# Altium project ADV7513.PrjPcb
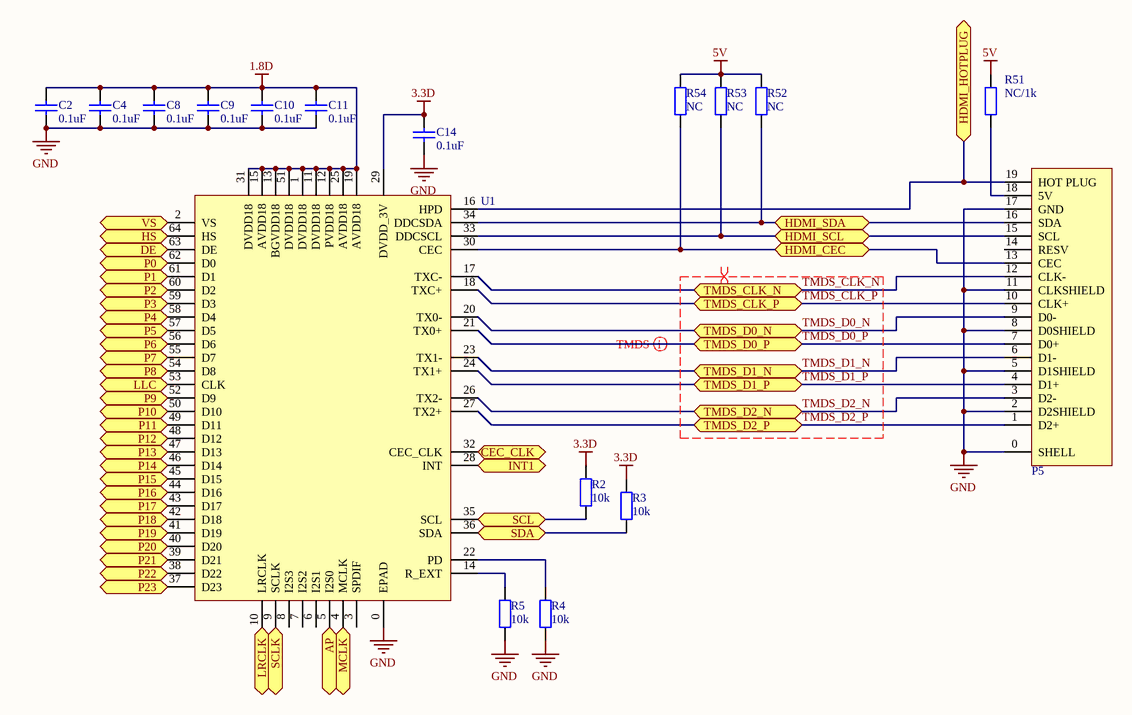
[diagram p0: HDMI.SchDoc]
3 sheets, 47 parts. Net scope: flat (ports and power ports of the same name join across sheets).
Board file: ADV7513.PcbDoc
Sheets:
  HDMI.SchDoc
  MCU.SchDoc
  interface.SchDoc

## Sheet HDMI.SchDoc
size A4

### Parts
C2  value 0.1uF  [0402]  (hidden comment: Cap)
C4  value 0.1uF  [0402]  (hidden comment: Cap)
C8  value 0.1uF  [0402]  (hidden comment: Cap)
C9  value 0.1uF  [0402]  (hidden comment: Cap)
C10  value 0.1uF  [0402]  (hidden comment: Cap)
C11  value 0.1uF  [0402]  (hidden comment: Cap)
C14  value 0.1uF  [0402]  (hidden comment: Cap)
P5  HDMI  [HDMI-A]  (value not drawn)
R2  10k  [0402]
R3  10k  [0402]
R4  10k  [0402]
R5  10k  [0402]
R51  NC/1k  [0402]
R52  NC  [0402]
R53  NC  [0402]
R54  NC  [0402]
U1  ADV7513  [ADV7611]  (value not drawn)

### Ports
AP, CEC_CLK, DE, HDMI_CEC, HDMI_HOTPLUG, HDMI_SCL, HDMI_SDA, HS, INT1, LLC, LRCLK, MCLK, P0, P1, P2, P3, P4, P5, P6, P7, P8, P9, P10, P11, P12, P13, P14, P15, P16, P17, P18, P19, P20, P21, P22, P23, SCL, SCLK, SDA, TMDS_CLK_N, TMDS_CLK_P, TMDS_D0_N, TMDS_D0_P, TMDS_D1_N, TMDS_D1_P, TMDS_D2_N, TMDS_D2_P, VS

### Nets
1.8D: C2.2 C4.2 C8.2 C9.2 C10.2 C11.2 U1.1(DVDD18) U1.11(DVDD18) U1.12(PVDD18) U1.13(BGVDD18) U1.15(AVDD18) U1.19(AVDD18) U1.25(AVDD18) U1.31(DVDD18) U1.51(DVDD18)
3.3D: C14.2 R2.1 R3.1 U1.29(DVDD_3V)
5V: R51.2 R52.1 R53.1 R54.1
GND: C2.1 C4.1 C8.1 C9.1 C10.1 C11.1 C14.1 P5.0(SHELL) P5.2(D2SHIELD) P5.5(D1SHIELD) P5.8(D0SHIELD) P5.11(CLKSHIELD) P5.17(GND) R4.2 R5.2 U1.0(EPAD)
TMDS_CLK_N: P5.12(CLK-) U1.17(TXC-) ; port TMDS_CLK_N
TMDS_CLK_P: P5.10(CLK+) U1.18(TXC+) ; port TMDS_CLK_P
TMDS_D0_N: P5.9(D0-) U1.20(TX0-) ; port TMDS_D0_N
TMDS_D0_P: P5.7(D0+) U1.21(TX0+) ; port TMDS_D0_P
TMDS_D1_N: P5.6(D1-) U1.23(TX1-) ; port TMDS_D1_N
TMDS_D1_P: P5.4(D1+) U1.24(TX1+) ; port TMDS_D1_P
TMDS_D2_N: P5.3(D2-) U1.26(TX2-) ; port TMDS_D2_N
TMDS_D2_P: P5.1(D2+) U1.27(TX2+) ; port TMDS_D2_P
NetP5_13: P5.13(CEC) R54.2 U1.30(CEC) ; port HDMI_CEC
NetP5_15: P5.15(SCL) R53.2 U1.33(DDCSCL) ; port HDMI_SCL
NetP5_16: P5.16(SDA) R52.2 U1.34(DDCSDA) ; port HDMI_SDA
NetP5_18: P5.18(5V) R51.1
NetP5_19: P5.19(HOT_PLUG) U1.16(HPD) ; port HDMI_HOTPLUG
NetR2_2: R2.2 U1.35(SCL) ; port SCL
NetR3_2: R3.2 U1.36(SDA) ; port SDA
NetR4_1: R4.1 U1.22(PD)
NetR5_1: R5.1 U1.14(R_EXT)
NetU1_2: U1.2(VS) ; port VS
NetU1_4: U1.4(MCLK) ; port MCLK
NetU1_5: U1.5(I2S0) ; port AP
NetU1_9: U1.9(SCLK) ; port SCLK
NetU1_10: U1.10(LRCLK) ; port LRCLK
NetU1_28: U1.28(INT) ; port INT1
NetU1_32: U1.32(CEC_CLK) ; port CEC_CLK
NetU1_37: U1.37(D23) ; port P23
NetU1_38: U1.38(D22) ; port P22
NetU1_39: U1.39(D21) ; port P21
NetU1_40: U1.40(D20) ; port P20
NetU1_41: U1.41(D19) ; port P19
NetU1_42: U1.42(D18) ; port P18
NetU1_43: U1.43(D17) ; port P17
NetU1_44: U1.44(D16) ; port P16
NetU1_45: U1.45(D15) ; port P15
NetU1_46: U1.46(D14) ; port P14
NetU1_47: U1.47(D13) ; port P13
NetU1_48: U1.48(D12) ; port P12
NetU1_49: U1.49(D11) ; port P11
NetU1_50: U1.50(D10) ; port P10
NetU1_52: U1.52(D9) ; port P9
NetU1_53: U1.53(CLK) ; port LLC
NetU1_54: U1.54(D8) ; port P8
NetU1_55: U1.55(D7) ; port P7
NetU1_56: U1.56(D6) ; port P6
NetU1_57: U1.57(D5) ; port P5
NetU1_58: U1.58(D4) ; port P4
NetU1_59: U1.59(D3) ; port P3
NetU1_60: U1.60(D2) ; port P2
NetU1_61: U1.61(D1) ; port P1
NetU1_62: U1.62(D0) ; port P0
NetU1_63: U1.63(DE) ; port DE
NetU1_64: U1.64(HS) ; port HS

Not connected (* = marked no-connect by the designer): P5 14(RESV); U1 3(SPDIF) 6(I2S1) 7(I2S2) 8(I2S3)

### Layout directives
differential pair: TMDS_CLK_N, TMDS_CLK_P, TMDS_D0_N, TMDS_D0_P, TMDS_D1_N, TMDS_D1_P, TMDS_D2_N, TMDS_D2_P
net class TMDS: TMDS_D0_P

### Library data of the parts
C2 C4 C8-C11 C14 = Cap: Capacitor; Published: 8-Jun-2000; LatestRevisionDate: 17-Jul-2002; LatestRevisionNote: Re-released for DXP Platform.; PackageReference: RAD-0.3; Publisher: Altium Limited; PackageDescription: Radial Cap, Thru-Hole; 2 Leads; 0.3 in Pin Spacing
R2-R5 R51-R54 = Res2: Resistor; Value: 0Ohm; Published: 8-Jun-2000; LatestRevisionDate: 17-Jul-2002; LatestRevisionNote: Re-released for DXP Platform.; PackageReference: AXIAL-0.4; Publisher: Altium Limited; PackageDescription: Axial Device, Thru-Hole; 2 Leads; 0.4 in Pin Spacing

## Sheet MCU.SchDoc
size A4
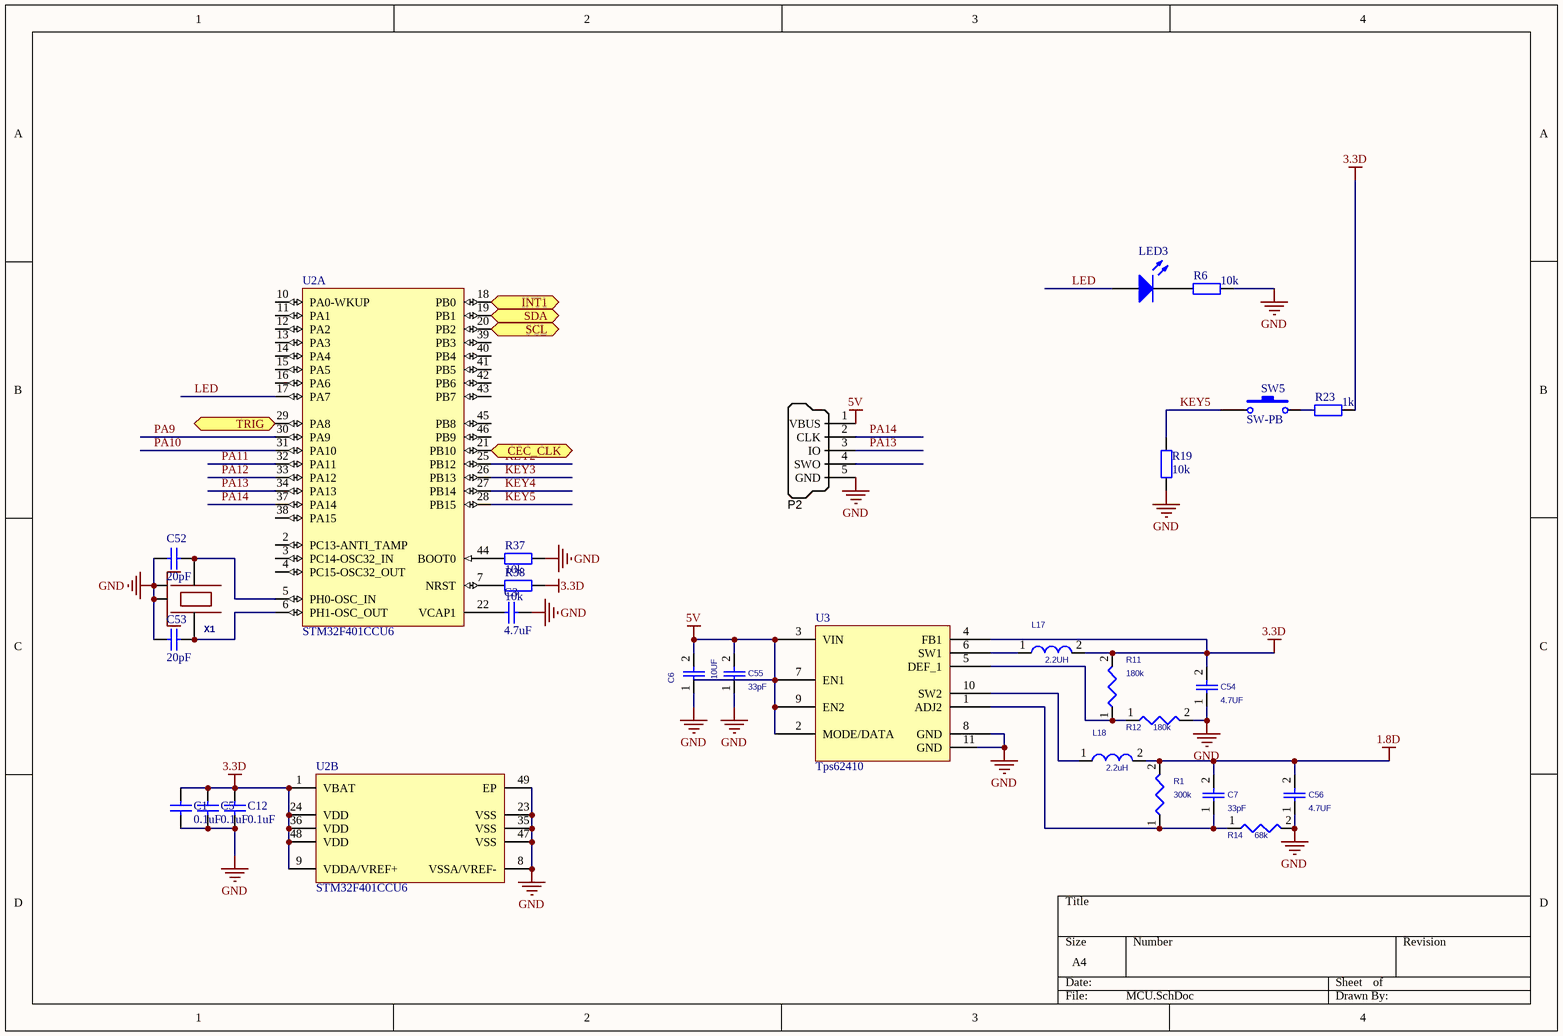
[diagram p1: MCU.SchDoc]

### Parts
C1  value 0.1uF  [0402]  (hidden comment: Cap)
C3  value 4.7uF  [0603]  (hidden comment: Cap)
C5  value 0.1uF  [0402]  (hidden comment: Cap)
C6  10UF  [0805]
C7  33pF  [0402]
C12  value 0.1uF  [0402]  (hidden comment: Cap)
C52  value 20pF  [0402]  (hidden comment: Cap)
C53  value 20pF  [0402]  (hidden comment: Cap)
C54  4.7UF  [0805]
C55  33pF  [0603L]
C56  4.7UF  [0805]
L17  2.2UH  [0806]
L18  2.2uH  [0806]
LED3  LED0  [0603]  (value not drawn)
P2  SWD_MicroUSB  [MICRO-YZX]  (value not drawn)
R1  300k  [0402]
R6  10k  [0402]
R11  180k  [0402]
R12  180k  [0402]
R14  68k  [0402]
R19  10k  [0402]
R23  1k  [0402]
R37  value 10k  [0402]  (hidden comment: Res2)
R38  value 10k  [0402]  (hidden comment: Res2)
SW5  SW-PB  [SW3x4]
U2  STM32F401CCU6  [STM-UFQFPN48_N]  (parts A,B of 2)
U3  Tps62410  [DFN-10P-3X3]
X1  24.000 KHz 3.2x2.5mm 8-10pf  [OSCILLATOR-3.2X2.5]  (value not drawn)

### Ports
CEC_CLK, INT1, SCL, SDA, TRIG

### Nets
1.8D: C7.2 C56.2 L18.2 R1.2
3.3D: C1.2 C5.2 C12.2 C54.2 L17.2 R11.2 R23.2 R38.1 U2.1(VBAT) U2.9(VDDA/VREF+) U2.24(VDD) U2.36(VDD) U2.48(VDD) U3.4(FB1)
5V: C6.2 C55.2 P2.1(VBUS) U3.2(MODE/DATA) U3.3(VIN) U3.7(EN1) U3.9(EN2)
GND: C1.1 C3.1 C5.1 C6.1 C12.1 C52.1 C53.1 C54.1 C55.1 C56.1 P2.5(GND) R6.2 R12.2 R14.2 R19.1 R37.2 U2.8(VSSA/VREF-) U2.23(VSS) U2.35(VSS) U2.47(VSS) U2.49(EP) U3.8(GND) U3.11(GND) X1.2(NC_2) X1.4(NC_4)
KEY2: U2.25(PB12)
KEY3: U2.26(PB13)
KEY4: U2.27(PB14)
KEY5: R19.2 SW5.1 U2.28(PB15)
LED: LED3.1(A) U2.17(PA7)
PA9: U2.30(PA9)
PA10: U2.31(PA10)
PA11: U2.32(PA11)
PA12: U2.33(PA12)
PA13: P2.3(IO) U2.34(PA13)
PA14: P2.2(CLK) U2.37(PA14)
NetC3_2: C3.2 U2.22(VCAP1)
NetC7_1: C7.1 R1.1 R14.1 U3.1(ADJ2)
NetC52_2: C52.2 U2.5(PH0-OSC_IN) X1.1
NetC53_2: C53.2 U2.6(PH1-OSC_OUT) X1.3
NetL17_1: L17.1 U3.6(SW1)
NetL18_1: L18.1 U3.10(SW2)
NetLED3_2: LED3.2(K) R6.1
NetR2_2: U2.20(PB2) ; port SCL
NetR3_2: U2.19(PB1) ; port SDA
NetR11_1: R11.1 R12.1 U3.5(DEF_1)
NetR23_1: R23.1 SW5.2
NetR37_1: R37.1 U2.44(BOOT0)
NetR38_2: R38.2 U2.7(NRST)
NetU1_28: U2.18(PB0) ; port INT1
NetU1_32: U2.21(PB10) ; port CEC_CLK
NetU2_29: U2.29(PA8) ; port TRIG

Not connected (* = marked no-connect by the designer): P2 4(SWO); U2 2(PC13-ANTI_TAMP) 3(PC14-OSC32_IN) 4(PC15-OSC32_OUT) 10(PA0-WKUP) 11(PA1) 12(PA2) 13(PA3) 14(PA4) 15(PA5) 16(PA6) 38(PA15) 39(PB3) 40(PB4) 41(PB5) 42(PB6) 43(PB7) 45(PB8) 46(PB9)

### Library data of the parts
C1 C3 C5 C12 C52 C53 = Cap: Capacitor; Published: 8-Jun-2000; LatestRevisionDate: 17-Jul-2002; LatestRevisionNote: Re-released for DXP Platform.; PackageReference: RAD-0.3; Publisher: Altium Limited; PackageDescription: Radial Cap, Thru-Hole; 2 Leads; 0.3 in Pin Spacing
C6 C54-C56 = CAP/0402: 1st Part Field: 0402
C7 = CAP/0402: 1st Part Field: 0402
L17 L18 = L/2.5*2.0
LED3 = LED0: Typical INFRARED GaAs LED; Published: 8-Jun-2000; LatestRevisionDate: 08-Jul-2005; LatestRevisionNote: Mech Layer 1 removed.; PackageReference: LED-0; Publisher: Altium Limited; PackageDescription: LED; 2 Leads
P2 = SWD_MicroUSB: Connector SMD USB Micro Type B middle mount; Manufacturer 1: Molex Inc; SCDType: undef; Package / Case: SMD; Supplier 1: Digi-Key; Supplier Part Number 1: WM17142CT-ND
R1 R11 R12 R14 = RES/0402_3
R6 R19 R23 = Res2: Resistor; Value: 0Ohm; Published: 8-Jun-2000; LatestRevisionDate: 17-Jul-2002; LatestRevisionNote: Re-released for DXP Platform.; PackageReference: AXIAL-0.4; Publisher: Altium Limited; PackageDescription: Axial Device, Thru-Hole; 2 Leads; 0.4 in Pin Spacing
R37 R38 = Res2: Resistor; Published: 8-Jun-2000; LatestRevisionDate: 17-Jul-2002; LatestRevisionNote: Re-released for DXP Platform.; PackageReference: AXIAL-0.4; Publisher: Altium Limited; PackageDescription: Axial Device, Thru-Hole; 2 Leads; 0.4 in Pin Spacing
SW5 = SW-PB: Switch; Published: 24-Mar-1999; LatestRevisionDate: 17-Jul-2002; LatestRevisionNote: Re-released for DXP Platform.; PackageReference: SPST-2; Publisher: Altium Limited; PackageDescription: Switch; 2 Leads
U2 = STM32F401CCU6: ARM Cortex-M4 32-bit MCU+FPU, 105 DMIPS, 256 kB Flash, 64 kB Internal RAM, 36 I/Os, 48-pin UFQFPN, -40 to 85 degC, Tray; Manufacturer: STMicroelectronics; FLASH Size (Prog) (kB): 256; I/Os (High Current): 36; Internal RAM Size (kB): 64; Operating Frequency(F) (Processor speed) (MHz): 84; Supply Voltage(Vcc) max (V): 3.6; Supply Voltage(Vcc) min (V): 1.8; DatasheetVersion: Rev. 1; PackageVersion: Rev. 1, 04/2013; PackageReference: UFQFPN48; PackageDescription: 48-Pin Ultra Thin Fine Pitch Quad Flat No-Lead, 7 x 7 x 0.6 mm Body, 0.5 mm Pitch, Exposed Pad; Supplier 1: Newark; Supplier Part Number 1: 19X6217; Supplier 2: Mouser; Supplier Part Number 2: 511-STM32F401CCU6; Core: ARM Cortex-M4; Packing: Tray; Mounting Technology: Surface Mount; PartNumber: STM32F401CCU6; ComponentLink1Description: Manufacturer URL; ComponentLink1URL: http://www.st.com/web/en/home.html; ComponentLink2Description: Datasheet; ComponentLink2URL: http://www.st.com/st-web-ui/static/active/en/resource/technical/document/data_brief/DM00071938.pdf; ComponentLink3Description: Package Specification; ComponentLink3URL: http://www.st.com/st-web-ui/static/active/en/resource/technical/document/data_brief/DM00071938.pdf
X1 = OSCILLATOR-3.2X2.5: Crystal Oscillator in 3.2x2.5 SMD

## Sheet interface.SchDoc
size A4
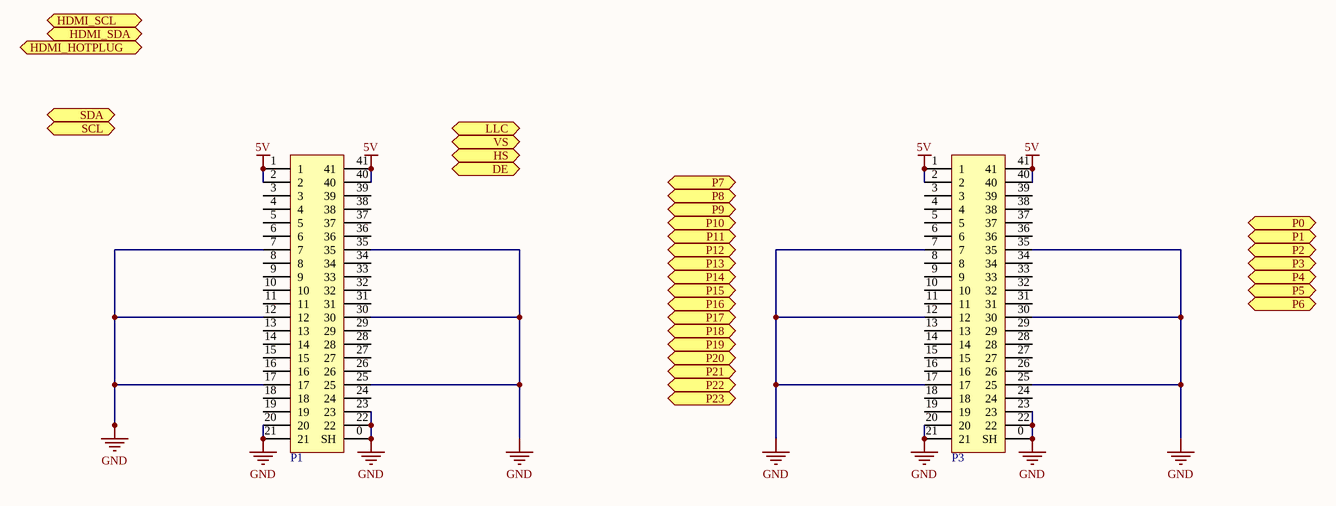
[diagram p2: interface.SchDoc]

### Parts
P1  DF9-41S  [DF9-41S]  (value not drawn)
P3  DF9-41S  [DF9-41S]  (value not drawn)

### Ports
DE, HDMI_HOTPLUG, HDMI_SCL, HDMI_SDA, HS, LLC, P0, P1, P2, P3, P4, P5, P6, P7, P8, P9, P10, P11, P12, P13, P14, P15, P16, P17, P18, P19, P20, P21, P22, P23, SCL, SDA, VS

### Nets
5V: P1.1 P1.2 P1.40 P1.41 P3.1 P3.2 P3.40 P3.41
GND: P1.0(SH) P1.7 P1.12 P1.17 P1.20 P1.21 P1.22 P1.23 P1.25 P1.30 P1.35 P3.0(SH) P3.7 P3.12 P3.17 P3.20 P3.21 P3.22 P3.23 P3.25 P3.30 P3.35

Not connected (* = marked no-connect by the designer): P1 3 4 5 6 8 9 10 11 13 14 15 16 18 19 24 26 27 28 29 31 32 33 34 36 37 38 39; P3 3 4 5 6 8 9 10 11 13 14 15 16 18 19 24 26 27 28 29 31 32 33 34 36 37 38 39

## Nets that join several sheets
1.8D: HDMI (15 pins), MCU (C7.2 C56.2 L18.2 R1.2)
3.3D: HDMI (C14.2 R2.1 R3.1 U1.29), MCU (14 pins)
5V: HDMI (R51.2 R52.1 R53.1 R54.1), MCU (7 pins), interface (8 pins)
GND: HDMI (16 pins), MCU (25 pins), interface (22 pins)
NetR2_2: HDMI (R2.2 U1.35), MCU (U2.20)
NetR3_2: HDMI (R3.2 U1.36), MCU (U2.19)
NetU1_28: HDMI (U1.28), MCU (U2.18)
NetU1_32: HDMI (U1.32), MCU (U2.21)